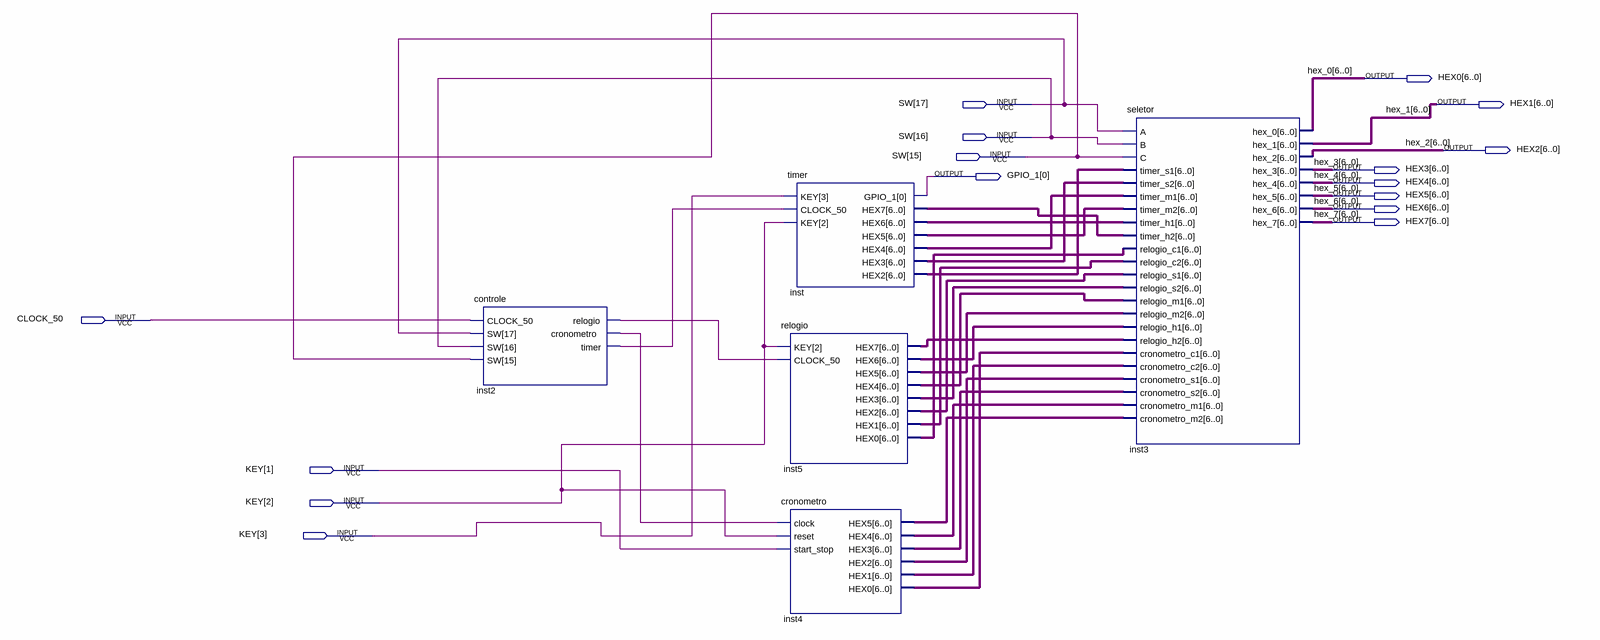
[diagram p0: schematic sheet]
// Quartus schematic relogio_final.bdf as structural Verilog: 5 symbols, 16 pins
module relogio_final (
  input  [17:15] SW,
  input  CLOCK_50,
  input  [3:1] KEY,
  output [6:0] HEX0,
  output [6:0] HEX1,
  output [6:0] HEX2,
  output [6:0] HEX3,
  output [0:0] GPIO_1,
  output [6:0] HEX4,
  output [6:0] HEX5,
  output [6:0] HEX6,
  output [6:0] HEX7
);

  wire inst2_cronometro, inst2_relogio, inst2_timer;
  wire [6:0] inst4_hex0, inst4_hex1, inst4_hex2, inst4_hex3, inst4_hex4, inst4_hex5, inst5_hex0, inst5_hex1,
       inst5_hex2, inst5_hex3, inst5_hex4, inst5_hex5, inst5_hex6, inst5_hex7, inst_hex2, inst_hex3,
       inst_hex4, inst_hex5, inst_hex6, inst_hex7;

  controle inst2 (
    .CLOCK_50(CLOCK_50), .SW(SW), .relogio(inst2_relogio), .cronometro(inst2_cronometro), .timer(inst2_timer));
  timer inst (
    .KEY(KEY[3:2]), .CLOCK_50(inst2_timer), .GPIO_1(GPIO_1[0]), .HEX7(inst_hex7), .HEX6(inst_hex6),
    .HEX5(inst_hex5), .HEX4(inst_hex4), .HEX3(inst_hex3), .HEX2(inst_hex2));
  relogio inst5 (
    .KEY(KEY[2]), .CLOCK_50(inst2_relogio), .HEX7(inst5_hex7), .HEX6(inst5_hex6), .HEX5(inst5_hex5),
    .HEX4(inst5_hex4), .HEX3(inst5_hex3), .HEX2(inst5_hex2), .HEX1(inst5_hex1), .HEX0(inst5_hex0));
  cronometro inst4 (
    .clock(inst2_cronometro), .reset(KEY[2]), .start_stop(KEY[1]), .HEX5(inst4_hex5), .HEX4(inst4_hex4),
    .HEX3(inst4_hex3), .HEX2(inst4_hex2), .HEX1(inst4_hex1), .HEX0(inst4_hex0));
  seletor inst3 (
    .A(SW[17]), .B(SW[16]), .C(SW[15]), .timer_s1(inst_hex2), .timer_s2(inst_hex3), .timer_m1(inst_hex4),
    .timer_m2(inst_hex5), .timer_h1(inst_hex6), .timer_h2(inst_hex7), .relogio_c1(inst5_hex0),
    .relogio_c2(inst5_hex1), .relogio_s1(inst5_hex2), .relogio_s2(inst5_hex3), .relogio_m1(inst5_hex4),
    .relogio_m2(inst5_hex5), .relogio_h1(inst5_hex6), .relogio_h2(inst5_hex7), .cronometro_c1(inst4_hex0),
    .cronometro_c2(inst4_hex1), .cronometro_s1(inst4_hex2), .cronometro_s2(inst4_hex3),
    .cronometro_m1(inst4_hex4), .cronometro_m2(inst4_hex5), .hex_0(HEX0), .hex_1(HEX1), .hex_2(HEX2),
    .hex_3(HEX3), .hex_4(HEX4), .hex_5(HEX5), .hex_6(HEX6), .hex_7(HEX7));

  // Other names for the same wires on the sheet: hex_1[6:0] = HEX1; hex_0[6:0] = HEX0; hex_2[6:0] = HEX2;
  //   hex_3[6:0] = HEX3; hex_4[6:0] = HEX4; hex_5[6:0] = HEX5; hex_6[6:0] = HEX6; hex_7[6:0] = HEX7
endmodule
